# EAGLE design fonte1 (EAGLE 9.6.2)
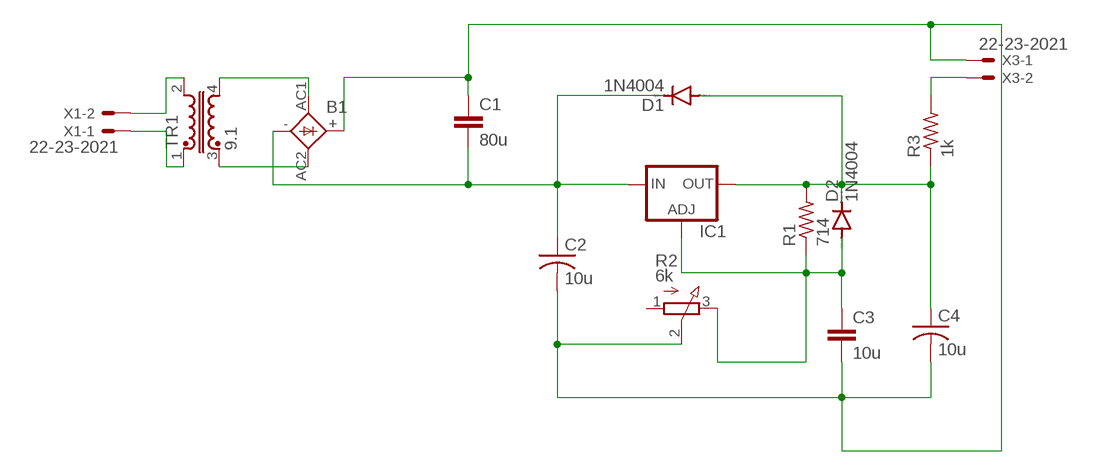
[diagram p0: schematic, sheet 1]

## Parts
B1  1KAB  [1KAB]
C1  80u  C-EU025-025X050  [C025-025X050]
C2  10u  C-US025-024X044  [C025-024X044]
C3  10u  C-EU025-025X050  [C025-025X050]
C4  10u  C-US025-024X044  [C025-024X044]
D1  1N4004  [DO41-10]
D2  1N4004  [DO41-10]
IC1  LM317TL  [317TL]
R1  714  R-US_0204/7  [0204/7]
R2  6k  3RP/1610N  [3RP/1610N]
R3  1k  R-US_0204/7  [0204/7]
TR1  9.1  U15-TRANSFORMER  [U15]
X1  22-23-2021  [22-23-2021]
X3  22-23-2021  [22-23-2021]

## Nets
N$1: TR1.2 X1.2
N$2: TR1.1 X1.1
N$3: B1.AC1 TR1.4
N$4: B1.AC2 TR1.3
N$5: B1.- C1.2 C2.1 D1.C IC1.3(IN)
N$6: R3.2 X3.2
N$8: C4.1 D1.A D2.C IC1.2(OUT) R1.2 R3.1
N$10: C3.1 D2.A IC1.1(ADJ) R1.1 R2.3(E)
N$15: B1.+ C1.1 C2.2 C3.2 C4.2 R2.2(S) X3.1
Unconnected: R2.1(A)

## Library data of the parts
B1 = rectifier:1KAB: RECTIFIER grid 5,08 x 5,08 mm
C1 C3 = rcl:C-EU: CAPACITOR, European symbol; SPICEPREFIX: C
C2 C4 = rcl:C-US: CAPACITOR, American symbol; SPICEPREFIX: C
D1 D2 = diode:1N4004: DIODE general purpose rectifier, 1 A
IC1 = v-reg:LM317TL: VOLTAGE REGULATOR
R1 R3 = rcl:R-US_: RESISTOR, American symbol; SPICEPREFIX: R
R2 = pot:3RP/1610N: 16mm Potentiometer one level Source: http://www.alphapotentiometers.net/html/16mm_pot_2.html
TR1 = inductor-neosid:U15: TRANSFORMER U15; OC_FARNELL: unknown; OC_NEWARK: unknown
X1 X3 = con-molex:22-23-2021: .100" (2.54mm) Center Header - 2 Pin; MF: MOLEX; MPN: 22-23-2021; OC_FARNELL: 1462926; OC_NEWARK: 25C3832

## Board
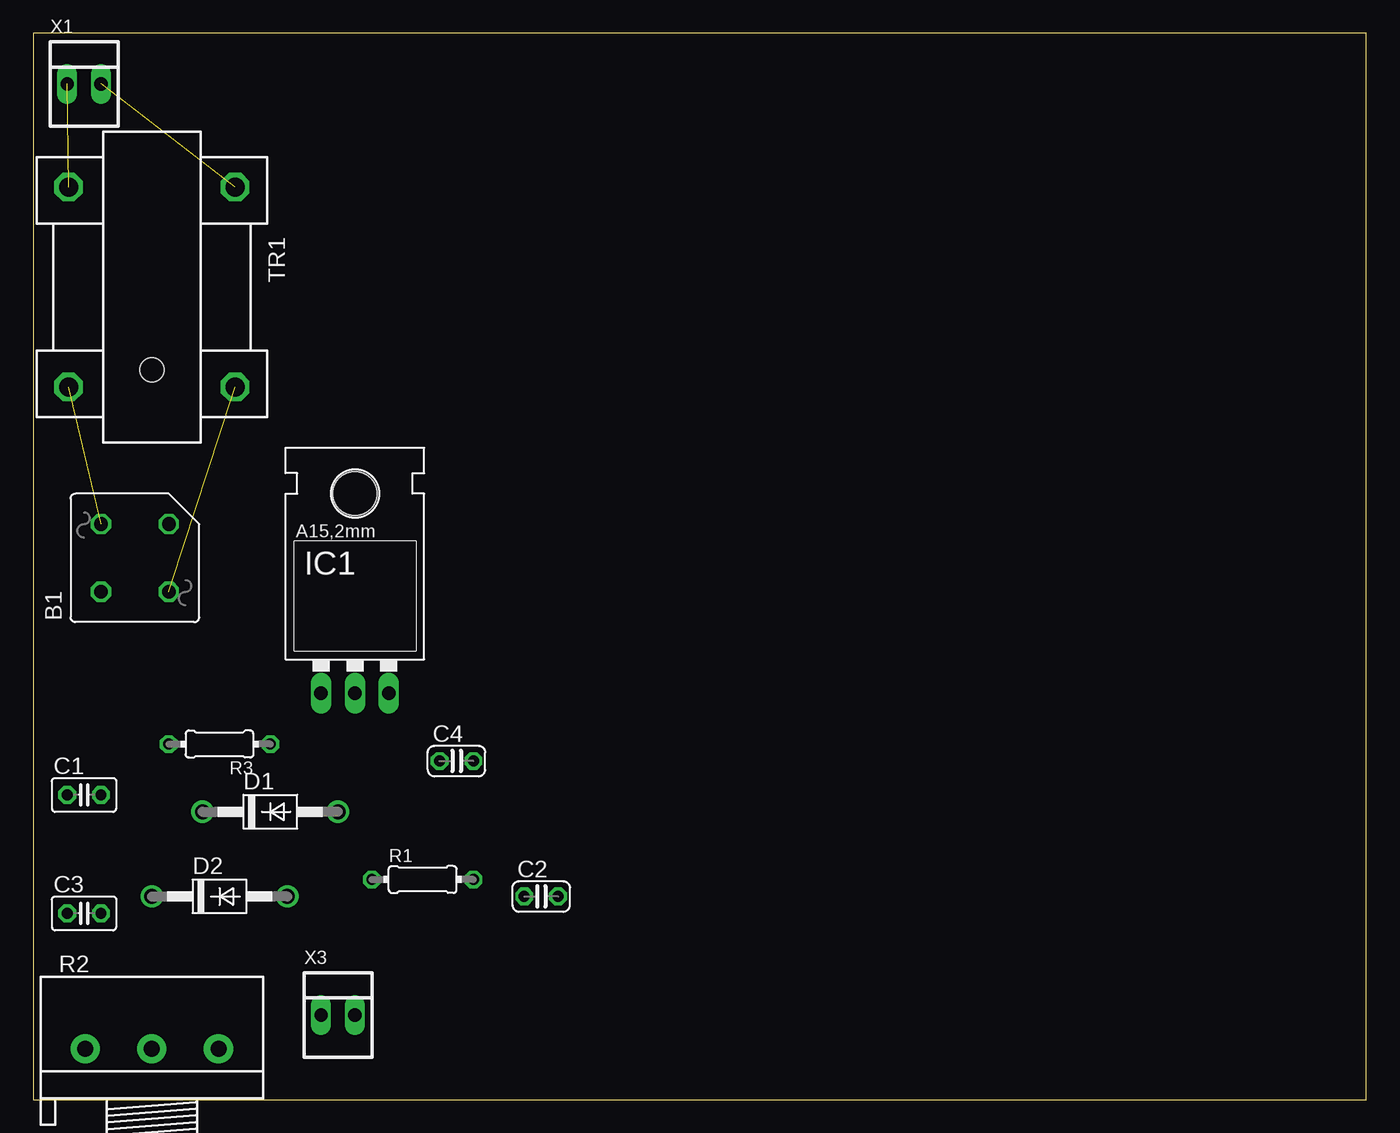
[diagram p1: board, top side]
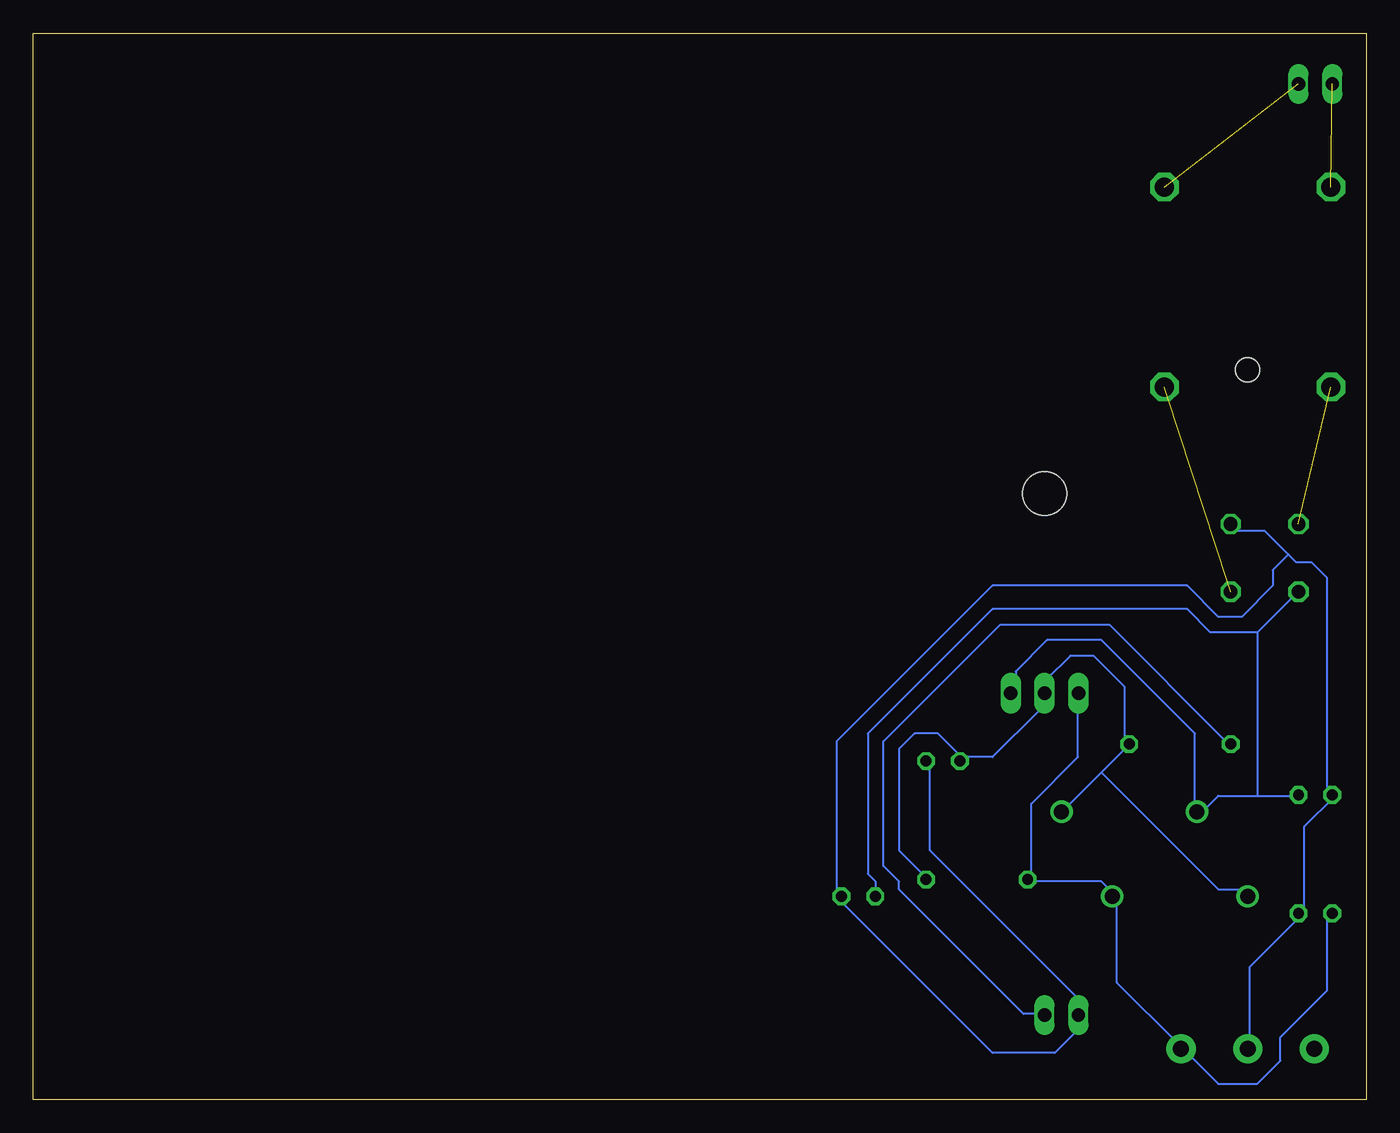
[diagram p2: board, bottom side, seen from below]

Size 100 x 80 mm. Coordinates in mm from the lower left corner, seen from the top.
Outline: 0,0 100,0 100,80 0,80 0,0
Copper layers (1*16): Top 0.035mm / dielectric 1.5mm / Bottom 0.035mm
Design rules "default *": minimum track width 6mil, minimum drill 0.35mm, track to track 40mil, track to pad 40mil, pad to pad 40mil, via to via 40mil, smd to smd 6mil, copper to edge 40mil, drill to drill 6mil, minimum pad ring 10mil, minimum via ring 8mil, stop-mask expansion 4mil, vias tented up to drill 0mil, thermal gap 10mil

### Footprints (pad centres in the part's own frame; a part is rotated, then mirrored left to right if it is on the bottom)
1KAB = drill 1.016 octagon: + 2.54,-2.54; - -2.54,2.54; AC1 -2.54,-2.54; AC2 2.54,2.54
C025-025X050 = drill 0.813 octagon: 1 -1.27,0; 2 1.27,0
C025-024X044 = drill 0.813 octagon: 1 -1.27,0; 2 1.27,0
DO41-10 = drill 1.118: A 5.08,0; C -5.08,0
317TL = drill 1.016 long: 1 -2.54,-3.81; 2 0,-3.81; 3 2.54,-3.81 | hole 3.302: 0,11.176
0204/7 = drill 0.813 octagon: 1 -3.81,0; 2 3.81,0
3RP/1610N = drill 1.2 pad 2.184: 1 -5,0; 2 0,0; 3 5,0
U15 = drill 1.422 octagon: 1 -7.5,-6.25; 2 -7.5,6.25; 3 7.5,-6.25; 4 7.5,6.25 | hole 1.8: 6.2,0
22-23-2021 = drill 1 long: 1 -1.27,0; 2 1.27,0

### Placement (x,y rotation side)
B1  7.62,40.64 90 top
C1  3.81,22.86 0 top
C2  38.1,15.24 0 top
C3  3.81,13.97 0 top
C4  31.75,25.4 0 top
D1  17.78,21.59 0 top
D2  13.97,15.24 0 top
IC1  24.13,34.29 0 top
R1  29.21,16.51 0 top
R2  8.89,3.81 0 top
R3  13.97,26.67 180 top
TR1  8.89,60.96 270 top
X1  3.81,76.2 0 top
X3  22.86,6.35 0 top

### Tracks (layer width: path | path; a pad name or v marks a point on that pad's centre or on a via)
N$1  (1 unrouted)
N$2  (1 unrouted)
N$3  (1 unrouted)
N$4  (1 unrouted)
N$5
  Bottom 0.152: 8.18,22.78 11.1,22.78 12.27,21.61 D1.C 12.85,21.61 12.85,27.46 19.86,34.47 23.95,34.47 26.29,32.13 26.29,30.96 IC1.3 | 8.18,22.78 5.26,22.78 C1.2 | 8.18,35.05 11.68,35.05 13.44,36.8 28.04,36.8 37.39,27.46 37.39,16.94 36.8,16.36 36.8,15.77 C2.1 | 8.18,35.05 5.26,37.97 B1.- | 8.18,35.05 8.18,22.78
N$6
  Bottom 0.152: R3.2 10.52,26.87 19.28,35.64 27.46,35.64 36.22,26.87 36.22,17.53 35.05,16.36 35.05,15.77 25.7,6.43 24.54,6.43 X3.2
N$8
  Bottom 0.152: 30.38,25.7 28.04,25.7 24.54,29.21 24.54,30.38 IC1.2 23.95,30.96 23.95,31.55 22.2,33.3 20.45,33.3 18.11,30.96 18.11,26.87 R3.1 18.11,26.29 19.86,24.54 | 30.38,25.7 32.13,27.46 33.88,27.46 35.05,26.29 35.05,18.69 33.3,16.94 R1.2 | 30.38,25.7 C4.1 | 19.86,24.54 22.78,21.61 D1.A | 19.86,24.54 11.1,15.77 9.35,15.77 D2.C
N$10
  Bottom 0.152: IC1.1 21.61,30.38 21.61,25.7 25.12,22.2 25.12,16.94 R1.1 25.12,16.36 19.86,16.36 19.28,15.77 D2.A 18.69,15.19 18.69,8.76 14.02,4.09 R2.3 13.44,3.5 11.1,1.17 8.18,1.17 6.43,2.92 6.43,4.67 2.92,8.18 2.92,13.44 C3.1
N$15
  Bottom 0.152: C4.2 32.72,25.12 32.72,18.69 21.61,7.59 21.61,6.43 X3.1 21.03,5.84 23.37,3.5 28.04,3.5 39.14,14.61 39.14,15.19 C2.2 39.73,15.77 39.73,26.87 28.04,38.56 13.44,38.56 11.1,36.22 9.35,36.22 7.01,38.56 7.01,39.73 5.84,40.89 | 5.84,40.89 5.26,40.31 4.09,40.31 2.92,39.14 2.92,23.37 C1.1 2.34,22.78 4.67,20.45 4.67,14.02 C3.2 5.26,13.44 8.76,9.93 8.76,4.09 R2.2 | 5.84,40.89 7.59,42.65 9.93,42.65 B1.+